# Altium schematic sheet 07_USB.SchDoc: =TitleParameter
size A3; Organization: ASISGUARD; Address1: Kemalpasa, Kemalpasa Cd. No:290 D:292H, 35060 Bornova/Izmir/Turkey; SheetNumber: 7; SheetTotal: 8
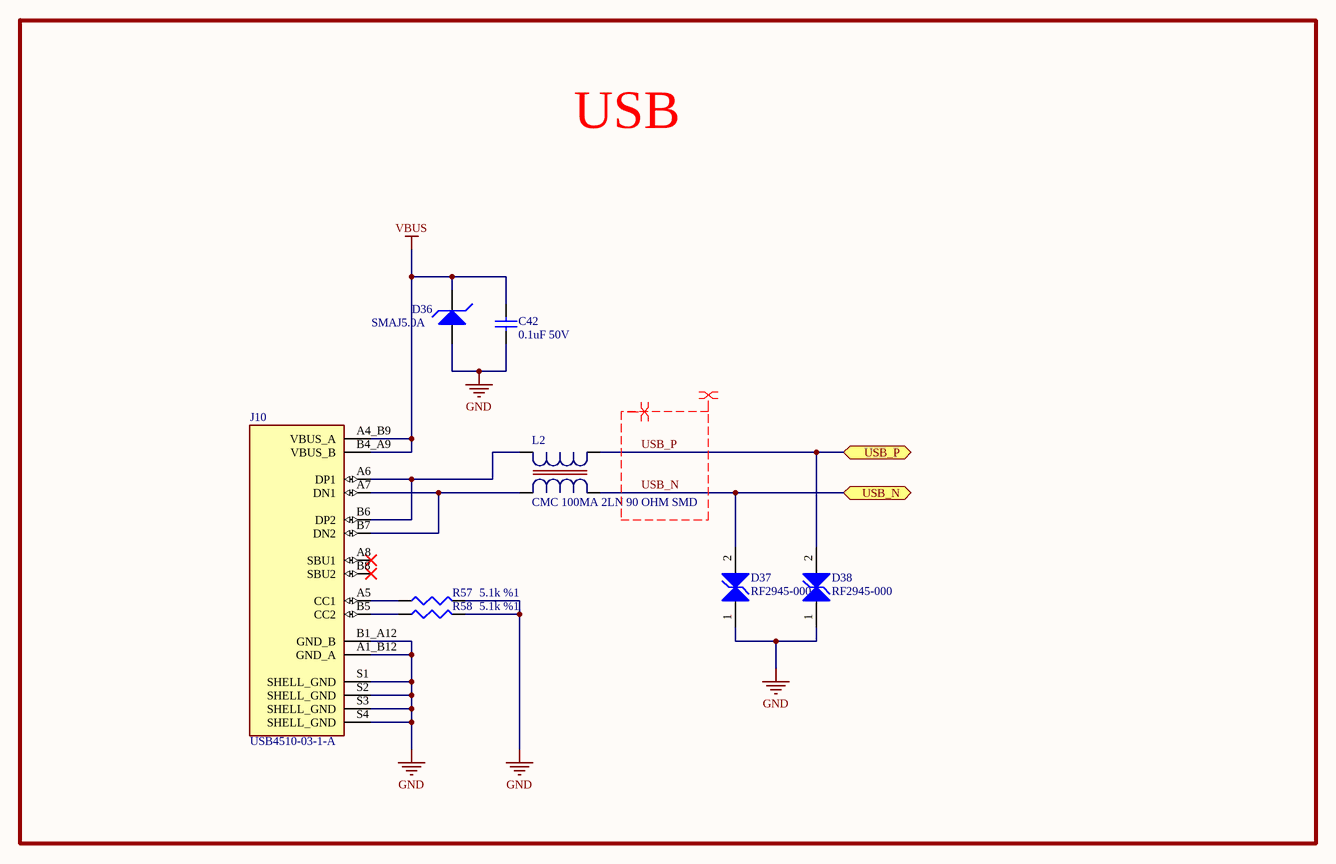
[diagram p0: 07_USB.SchDoc]

## Parts
C42  value 0.1uF 50V  [SMC0402]  (hidden comment: CAP CER 0.1UF 50V X7R 0402)
D36  SMAJ5.0A  [SMAJ5.0A]
D37  value RF2945-000  [Littelfuse_SESD0402_MFG]  (hidden comment: TVS DIODE 7VWM 10VC 0402)
D38  value RF2945-000  [Littelfuse_SESD0402_MFG]  (hidden comment: TVS DIODE 7VWM 10VC 0402)
J10  Manufacturer Part Number: USB4510-03-1-A  [GCT_USB4510-03-1-A_REVA]  (hidden comment: USB C REC 16P 3U" MID MNT 1.6MM)
L2  CMC 100MA 2LN 90 OHM SMD  [IND_MCZ1210AH_TDK]
R57  value 5.1k %1  [SMR0402]  (hidden comment: RES SMD 5.1K OHM 1% 1/16W 0402)
R58  value 5.1k %1  [SMR0402]  (hidden comment: RES SMD 5.1K OHM 1% 1/16W 0402)

## Blocks framed on the sheet
USB: C42 D36-D38 J10 L2 R57 R58

## Ports
USB_N (bidir), USB_P (bidir)

## Nets
GND: C42.1 D36.1(A) D37.1 D38.1 J10.A1_B12(GND_A) J10.B1_A12(GND_B) J10.S1(SHELL_GND) J10.S2(SHELL_GND) J10.S3(SHELL_GND) J10.S4(SHELL_GND) R57.2 R58.2
VBUS: C42.2 D36.2(K) J10.A4_B9(VBUS_A) J10.B4_A9(VBUS_B)
USB_N: D37.2 L2.3 ; port USB_N
USB_P: D38.2 L2.4 ; port USB_P
NetJ10_A5: J10.A5(CC1) R57.1
NetJ10_A6: J10.A6(DP1) J10.B6(DP2) L2.1
NetJ10_A7: J10.A7(DN1) J10.B7(DN2) L2.2
NetJ10_B5: J10.B5(CC2) R58.1

Not connected (* = marked no-connect by the designer): J10 A8(SBU1)* B8(SBU2)*

## Layout directives
differential pair; differential pair class DIFF_USB: USB_N, USB_P
net class USB: USB_N, USB_P

## Notes on the sheet
- Proje/Project:
- Sayfa Adı/Document Name:
- Çizilme Tarihi/Drawing Date
- Umit KAYACIK
- Tasarlayan/Designed By
- Sayfa/Sheet:
- Revision:
- of
- Son Güncelleme/Last Edit Date
- Kontrol eden/Checked By
- Onaylayan/Approved By
- Boyut/Size:
- Varyant/Variant:
- Dil/Language:
- A3
- ENG

## Library data of the parts
C42 = CAP0402_0.1UF_50V_1: 0.1 µF ±10% 50V Ceramic Capacitor X7R 0402 (1005 Metric); Manufacturer Part Number: GCM155R71H104KE02J; Order Code: DIGI: 490-14514-2-ND
D36 = SMAJ5.0A: 9.2V Clamp 43.5A Ipp Tvs Diode Surface Mount DO-214AC (SMA); Manufacturer: Littelfuse Inc.; MPN: SMAJ5.0A
D37 D38 = RF2945-000: 10V (Typ) Clamp 2A (8/20µs) Ipp Tvs Diode Surface Mount 0402; Manufacturer Part Number: SESD0402X1BN-0010-098; Order Code: DIGI: SESD0402X1BN-0010-098TR-ND
J10 = USB4510-03-1-A_REVA: USB-C (USB TYPE-C) USB 2.0 Receptacle Connector 24 (16+8 Dummy) Position Board Edge, Cutout; Surface Mount; Through Hole, Right Angle; Order Code: DIGI: 2073-USB4510-03-1-ATR-ND
L2 = MCZ1210AH900L2T: 2 Line Common Mode Choke Surface Mount 90 Ohms @ 100 MHz 100mA DCR 1.75Ohm; Manufacturer Part Number: MCZ1210AH900L2TA0G; LCSC Manufacturer Part Number: MCZ1210AH900L2TD0G; Order Code: Digi: 445-MCZ1210AH900L2TA0GTR-ND; LCSC Part Number: C435268
R57 R58 = RES0402_5.1K_%1: 5.1 kOhms ±1% 0.063W, 1/16W Chip Resistor 0402 (1005 Metric) Automotive AEC-Q200 Thick Film; Manufacturer Part Number: CRCW04025K10FKED; Order Code: DIGI: 541-5.10KLTR-ND